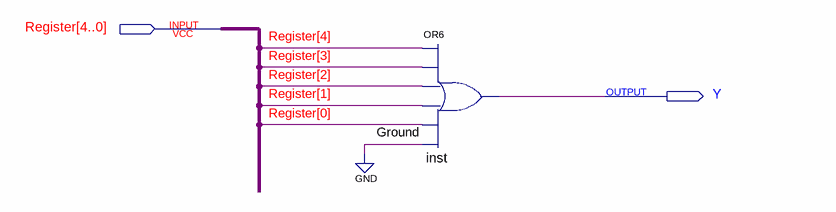
[diagram p0: schematic sheet]
// Quartus schematic NONZERO.bdf as structural Verilog: 1 symbols, 2 pins
module NONZERO (
  input  [4:0] Register,
  output Y
);

  or inst (Y, Register[4], Register[3], Register[2], Register[1], Register[0], 1'b0);
endmodule
